# EAGLE design BATT_FLEX8 (EAGLE 9.6.2)
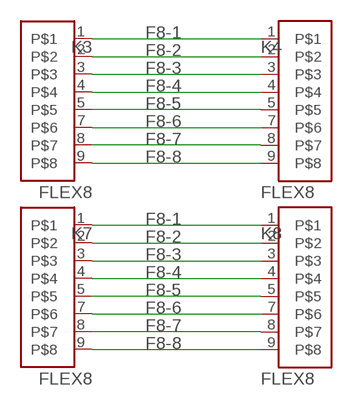
[diagram p0: schematic, sheet 1]

## Parts
K3  FLEX8  [FLEX8]
K4  FLEX8  [FLEX8]
K7  FLEX8  [FLEX8]
K8  FLEX8  [FLEX8]

## Nets
F8-1: K3.1 K4.1 K7.1 K8.1
F8-2: K3.2 K4.2 K7.2 K8.2
F8-3: K3.3 K4.3 K7.3 K8.3
F8-4: K3.4 K4.4 K7.4 K8.4
F8-5: K3.5 K4.5 K7.5 K8.5
F8-6: K3.7 K4.7 K7.7 K8.7
F8-7: K3.8 K4.8 K7.8 K8.8
F8-8: K3.9 K4.9 K7.9 K8.9

## Library data of the parts
K3 K4 K7 K8 = Flex_3mm:FLEX8: WR-FPC 1mm SMT Horiz. Bot. Contact Hinge type WR-FPC 1mm 08 pins Hinge type SMT Horizontal Bottom Contact ;=>Code : Con_FPC_ZIF_1.00_6861xx148922_686108148922 <http://katalog.we-online.de/media/images/eican/Con_FPC_ZIF_1.00_686110148922_pf2.jpg> Details see: http://katalog.we-online.de/em/datasheet/6861xx148922.pdf Created 2014-10-08, Karrer Zheng 2014 (C) Wurth Elektronik

## Board
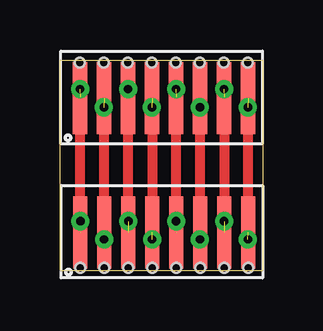
[diagram p1: board, top side]
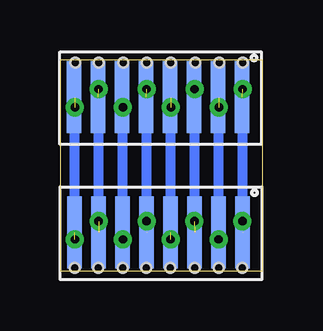
[diagram p2: board, bottom side, seen from below]

Size 8.45 x 8.8 mm. Coordinates in mm from the lower left corner, seen from the top.
Outline: 0,8.8 8.45,8.8 8.45,0 0,0 0,8.8
Copper layers (1*16): Top 0.035mm / dielectric 1.5mm / Bottom 0.035mm
Design rules "default *": minimum track width 6mil, minimum drill 0.35mm, track to track 6mil, track to pad 6mil, pad to pad 6mil, via to via 6mil, smd to smd 6mil, copper to edge 8mil, drill to drill 6mil, minimum pad ring 10mil, minimum via ring 8mil, stop-mask expansion 4mil, vias tented up to drill 50mil, thermal gap 10mil
Holes 0.4 mm at 0.85,0.12 1.84,0.12 2.84,0.12 3.85,0.12 4.85,0.12 5.84,0.12 6.85,0.12 7.84,0.12 0.83,8.68 1.82,8.68 2.82,8.68 3.83,8.68 4.83,8.68 5.82,8.68 6.83,8.68 7.82,8.68

### Footprints (pad centres in the part's own frame; a part is rotated, then mirrored left to right if it is on the bottom)
FLEX8 = smd 0.6 x 3: 1 0.8,2.05; 2 1.8,2.05; 3 2.8,2.05; 4 3.8,2.05; 5 4.8,2.05; 7 5.8,2.05; 8 6.8,2.05; 9 7.8,2.05

### Placement (x,y rotation side)
K3  0.05,-0.45 0 top
K4  0.03,5.15 0 top
K7  0.06,9.29 180 bottom
K8  0.04,3.65 180 bottom

### Tracks (layer width: path | path; a pad name or v marks a point on that pad's centre or on a via)
F8-1  (via drill 0.35)  (2 unrouted)
  Top 0.406: K4.1 0.84,7.19 K8.1 v0.84,2.06 v0.85,2.07
  Bottom 0.406: K8.1 0.84,7.22 K7.1
  other vias: 0.84,7.58
F8-2  (via drill 0.35)  (2 unrouted)
  Top 0.406: K4.2 1.84,7.19 K8.2 v1.84,1.31
  Bottom 0.406: K8.2 1.84,7.22 K7.2
  other vias: 1.83,6.82
F8-3  (via drill 0.35)  (2 unrouted)
  Top 0.406: K8.3 2.84,7.19 K4.3 v2.84,7.57 v2.84,7.58
  Bottom 0.406: K8.3 2.84,7.22 K7.3
  other vias: 2.85,2.07
F8-4  (via drill 0.35)  (3 unrouted)
  Top 0.406: K8.4 K4.4
  Bottom 0.406: K8.4 3.84,7.22 K7.4
  other vias: 3.83,6.82 3.84,1.31
F8-5  (via drill 0.35)  (2 unrouted)
  Top 0.406: K4.5 4.84,7.19 K8.5 v4.84,2.07
  Bottom 0.406: K8.5 4.84,7.22 K7.5
  other vias: 4.84,7.58
F8-6  (via drill 0.35)  (1 unrouted)
  Top 0.406: v5.83,1.31 5.84,1.32 K8.7 K4.7 v5.84,6.82 v5.83,6.82
  Bottom 0.406: K8.7 5.84,7.22 K7.7
F8-7  (via drill 0.35)  (3 unrouted)
  Top 0.406: K4.8 6.84,7.19 K8.8
  Bottom 0.406: K8.8 6.84,7.22 K7.8
  other vias: 6.84,7.58 6.84,2.07
F8-8  (via drill 0.35)  (3 unrouted)
  Top 0.406: K8.9 7.84,7.19 K4.9
  Bottom 0.406: K8.9 7.84,7.22 K7.9
  other vias: 7.83,1.31 7.83,6.82